# Altium schematic sheet Sheet1.SchDoc
size A4
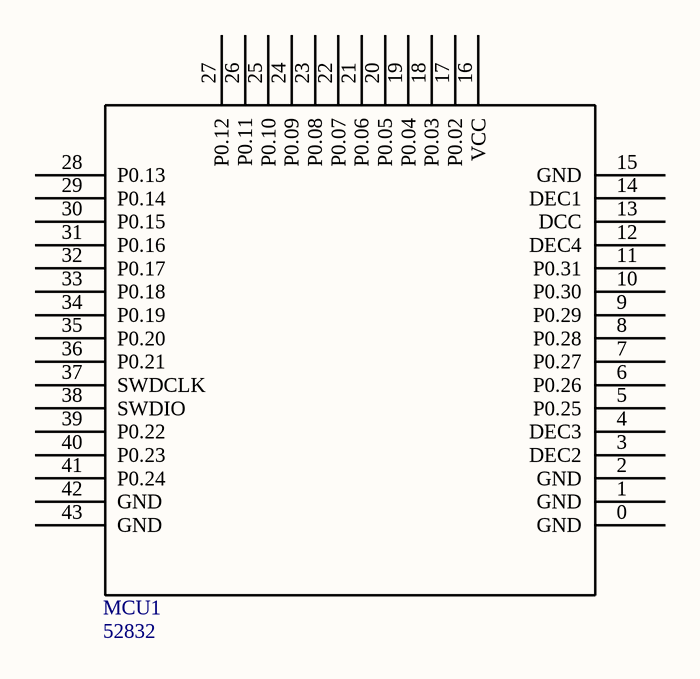
[diagram p0: Sheet1.SchDoc]

## Parts
MCU1  52832  [EBYTE 52832]

## Nets

Not connected (* = marked no-connect by the designer): MCU1 0(GND) 1(GND) 2(GND) 3(DEC2) 4(DEC3) 5(P0.25) 6(P0.26) 7(P0.27) 8(P0.28) 9(P0.29) 10(P0.30) 11(P0.31) 12(DEC4) 13(DCC) 14(DEC1) 15(GND) 16(VCC) 17(P0.02) 18(P0.03) 19(P0.04) 20(P0.05) 21(P0.06) 22(P0.07) 23(P0.08) 24(P0.09) 25(P0.10) 26(P0.11) 27(P0.12) 28(P0.13) 29(P0.14) 30(P0.15) 31(P0.16) 32(P0.17) 33(P0.18) 34(P0.19) 35(P0.20) 36(P0.21) 37(SWDCLK) 38(SWDIO) 39(P0.22) 40(P0.23) 41(P0.24) 42(GND) 43(GND)

## Library data of the parts
MCU1 = Component_1